# Altium schematic sheet 5V_Power_Supply.SchDoc: STM32F446 CNC
size B; Author: AM; CompanyName: Expatria Technologies; DrawnBy: A.Marles; Engineer: AM; Organization: Expatria Technolgoies; Address1: PO Box 2084; Address3: Merritt, BC V1K 1B8; Address4: Canada; DocumentNumber: 24; SheetNumber: 21; SheetTotal: 26
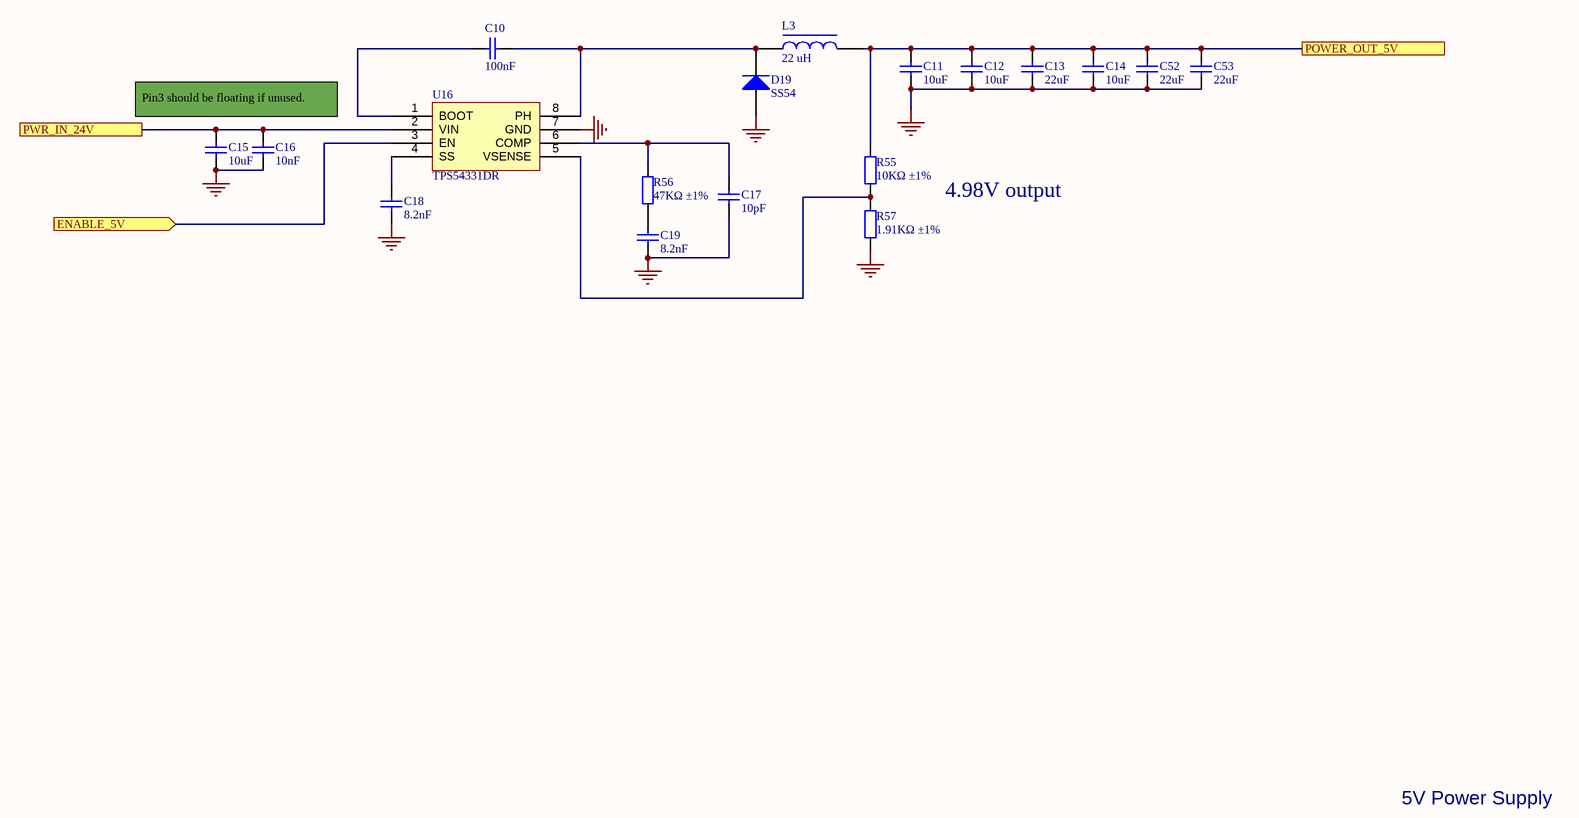
[diagram p0: 5V_Power_Supply.SchDoc]

## Parts
C10  100nF  [0603_C]
C11  10uF  [1206_C]
C12  10uF  [1206_C]
C13  22uF  [0805_C]
C14  10uF  [1206_C]
C15  10uF  [1206_C]
C16  10nF  [0603_C]
C17  10pF  [0603_C]
C18  8.2nF  [0603_C]
C19  8.2nF  [0603_C]
C52  22uF  [0805_C]
C53  22uF  [0805_C]
D19  SS54  [SMA(DO-214AC)_S1]
L3  22 uH  [INDPM7366X300N]
R55  10KΩ ±1%  [0603_R]
R56  47KΩ ±1%  [0603_R]
R57  1.91KΩ ±1%  [0603_R]
U16  TPS54331DR  [SOIC-8_150mil]

## Ports
ENABLE_5V (in), POWER_OUT_5V, PWR_IN_24V

## Nets
GND: C11.1 C12.1 C13.1 C14.1 C15.1 C16.1 C17.1 C18.1 C19.1 C52.1 C53.1 D19.1(A) R57.1 U16.7(GND)
ENABLE_5V: U16.3(EN) ; port ENABLE_5V
POWER_OUT_5V: C11.2 C12.2 C13.2 C14.2 C52.2 C53.2 L3.2 R55.2 ; port POWER_OUT_5V
PWR_IN_24V: C15.2 C16.2 U16.2(VIN) ; port PWR_IN_24V
NetC10_1: C10.1 U16.1(BOOT)
NetC10_2: C10.2 D19.2(K) L3.1 U16.8(PH)
NetC17_2: C17.2 R56.2 U16.6(COMP)
NetC18_2: C18.2 U16.4(SS)
NetC19_2: C19.2 R56.1
NetR55_1: R55.1 R57.2 U16.5(VSENSE)

## Notes on the sheet
- Pin3 should be floating if unused.
- 4.98V output
- 5V Power Supply
- SHEET
- Expatria Technologies
- 625 Kane Valley Rd.
- Box 2084
- Merritt, BC V1K1B8
- PROJECT
- SIZE
- ENGR
- MODIFIED
- DOCUMENT
- REV
- Copyright Sienci Labs 2024. This document describes Open Hardware and is licensed under the CERN-OHL-S v2. No warranty is implied or expressed.
- EMAIL: INFO@EXPATRIA.CA
- B
- /

## Library data of the parts
C10 = 0603 100nF (104) 10% 50V: 50V 100nF X7R ±10% 0603 Multilayer Ceramic Capacitors MLCC - SMD/SMT ROHS; Manufacturer: YAGEO; Manufacturer Part Number: CC0603KRX7R9BB104; Package: 0603; Supplier: LC; SuppliersPartNumber: C14663; Capacitance: 100nF; Tolerance: 10%; Voltage: 50V; ComponentLink1Description: Supplier link; ComponentLink1URL: http://www.szlcsc.com/product/details_15331.html
C11 C12 C14 C15 = 1206 10uF (106) 10% 50V: 50V 10uF X5R ±10% 1206 Multilayer Ceramic Capacitors MLCC - SMD/SMT ROHS; Manufacturer: Samsung Electro-Mechanics; Manufacturer Part Number: CL31A106KBHNNNE; Package: 1206; Supplier: LC; SuppliersPartNumber: C13585; Capacitance: 10uF; Tolerance: 10%; Voltage: 50V
C13 C52 C53 = 0805 22uF (226) 20% 25V: 25V 22uF X5R ±20% 0805 Multilayer Ceramic Capacitors MLCC - SMD/SMT ROHS; Manufacturer: Samsung Electro-Mechanics; Manufacturer Part Number: CL21A226MAQNNNE; Package: 0805; Supplier: LC; SuppliersPartNumber: C45783; Capacitance: 22uF; Tolerance: 20%; Voltage: 25V; ComponentLink1Description: Supplier link; ComponentLink1URL: http://www.szlcsc.com/product/details_46786.html
C16 = 0603 10nF (103) 10% 50V: 50V 10nF X7R ±10% 0603 Multilayer Ceramic Capacitors MLCC - SMD/SMT ROHS; Manufacturer: Guangdong Fenghua Advanced Tech; Manufacturer Part Number: 0603B103K500NT; Package: 0603; Supplier: LC; SuppliersPartNumber: C57112; Capacitance: 10nF; Tolerance: 10%; Voltage: 50V; ComponentLink1Description: Supplier link; ComponentLink1URL: http://www.szlcsc.com/product/details_58143.html
C17 = 0603 10pF (100) 5% 50V: Chip capacitors; Manufacturer: Samsung Electro-Mechanics; Manufacturer Part Number: CL10C100JB8NNNC; Tolerance: 5%; Voltage: 50V; Package: 0603; Supplier: LCSC; SuppliersPartNumber: C1634; Capacitance: 10pF; ComponentLink1Description: Supplier link; ComponentLink1URL: http://www.szlcsc.com/product/details_1986.html
C18 C19 = 0603 8.2nF (822) 10% 50V: 50V 8.2nF X7R ±10% 0603 Multilayer Ceramic Capacitors MLCC - SMD/SMT ROHS; Manufacturer: YAGEO; Manufacturer Part Number: CC0603KRX7R9BB822; Package: 0603; Supplier: LC; SuppliersPartNumber: C113812; Capacitance: 8.2nF; Tolerance: 10%; Voltage: 50V; Manufacturer 1: YAGEO; Manufacturer Part Number 1: CC0603KRX7R9BB822; Value: 8.2nF
D19 = SMA(DO-214AC) SS54: 40V 5A 550mV@5A; Manufacturer 1: MDD; Package: SMA(DO-214AC); Supplier: LCSC; SuppliersPartNumber: C22452; Manufacturer Part Number 1: SS54; Manufacturer: MDD; Manufacturer Part Number: SS54
L3 = 1206 10uH 10%: 3A 22uH ±20% 130mΩ SMD,7.1x6.6x3mm Power Inductors ROHS; Manufacturer: YJYCOIN; Manufacturer Part Number: YSPI0630A-220M; Package: SMD,7.1x6.6x3mm; Supplier: LCSC; SuppliersPartNumber: C497873
R55 = 0603 10K (1002) 1%: Chip resistor; Manufacturer: Uniroyal Elec; Manufacturer Part Number: 0603WAF1002T5E; Power: 1/10W; Package: 0603; Supplier: LCSC; SuppliersPartNumber: C25804; Resistance: 10KΩ; Tolerance: 1%; ComponentLink1Description: Supplier link; ComponentLink1URL: http://www.szlcsc.com/product/details_26547.html
R56 = 0603 47K (4702) 1%: Chip resistor; Manufacturer: Uniroyal Elec; Manufacturer Part Number: 0603WAF4702T5E; Power: 1/10W; Package: 0603; Supplier: LCSC; SuppliersPartNumber: C25819; Resistance: 47KΩ; Tolerance: 1%; ComponentLink1Description: Supplier link; ComponentLink1URL: http://www.szlcsc.com/product/details_26562.html
R57 = 0603 1.91K (2001) 1%: Chip resistor; Manufacturer: TyoHM; PartNumber: RMC06031.91K1%N; Power: 1/10W; Package: 0603; Supplier: LC; SuppliersPartNumber: C325662; Resistance: 1.91KΩ; Tolerance: 1%; ComponentLink1Description: Supplier link; ComponentLink1URL: http://www.szlcsc.com/product/details_23702.html
U16 = TPS54331DR_[C9865]: Switching Voltage Regulators 3A 28V In Step Down SWIFT DC/DC Cnvrtr; Manufacturer: Texas Instruments; Package: SOIC-8_150mil; Supplier: LCSC; SuppliersPartNumber: C9865; Manufacturer Part Number: TPS54331DR